# Altium schematic sheet SOC.SchDoc
size A1
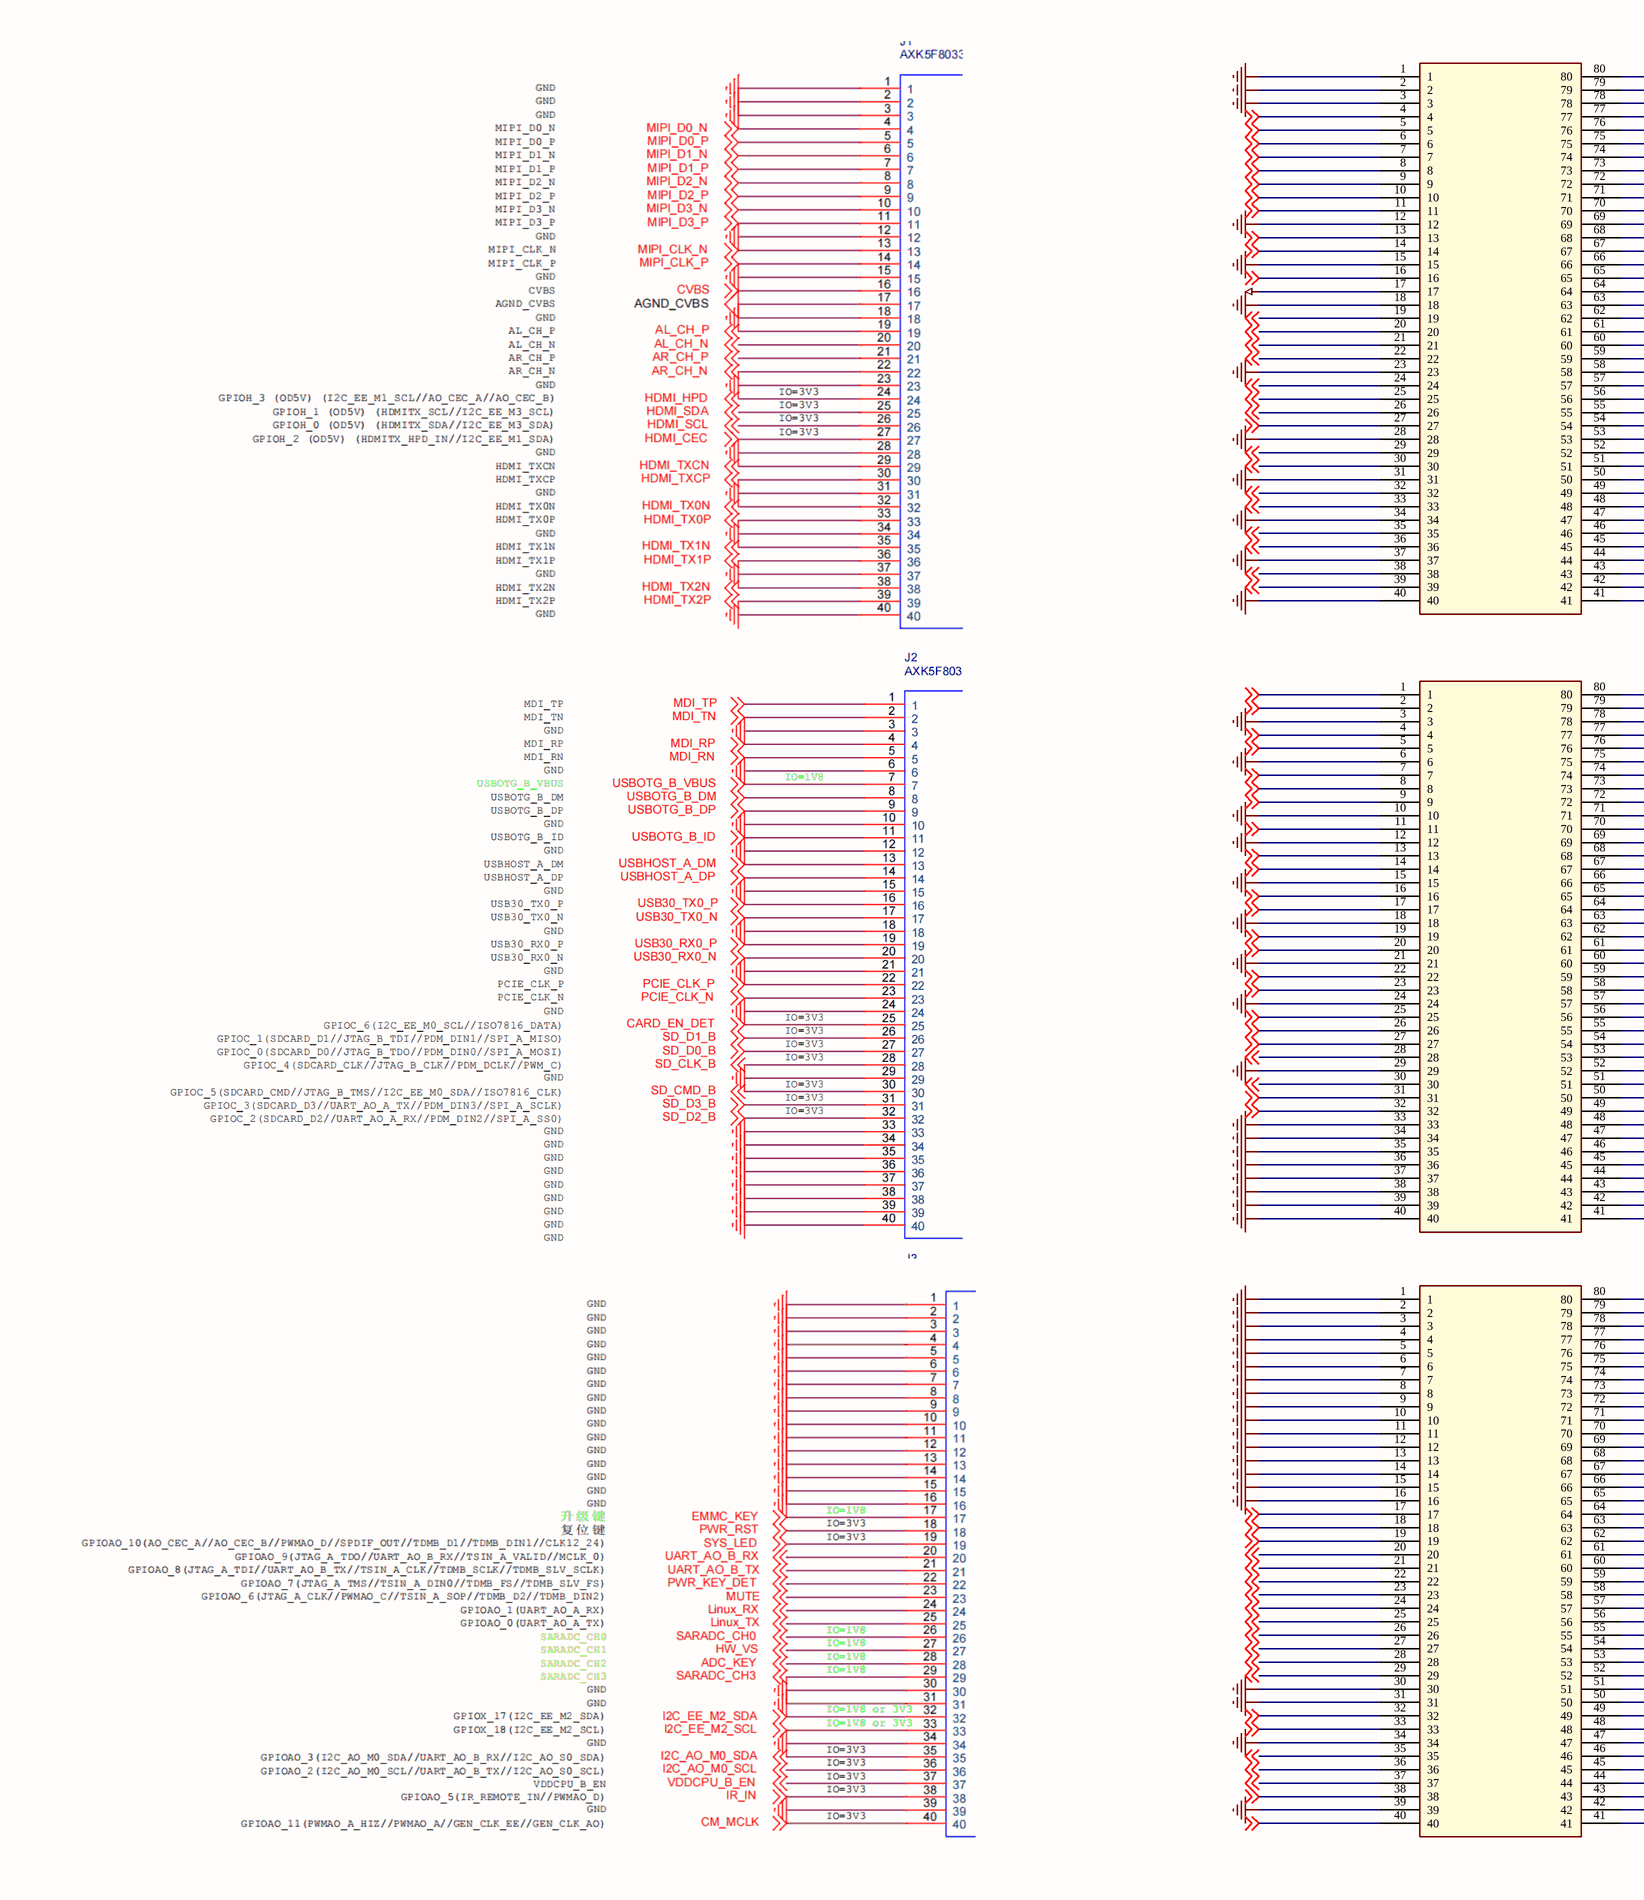
[diagram p0: SOC.SchDoc, left]
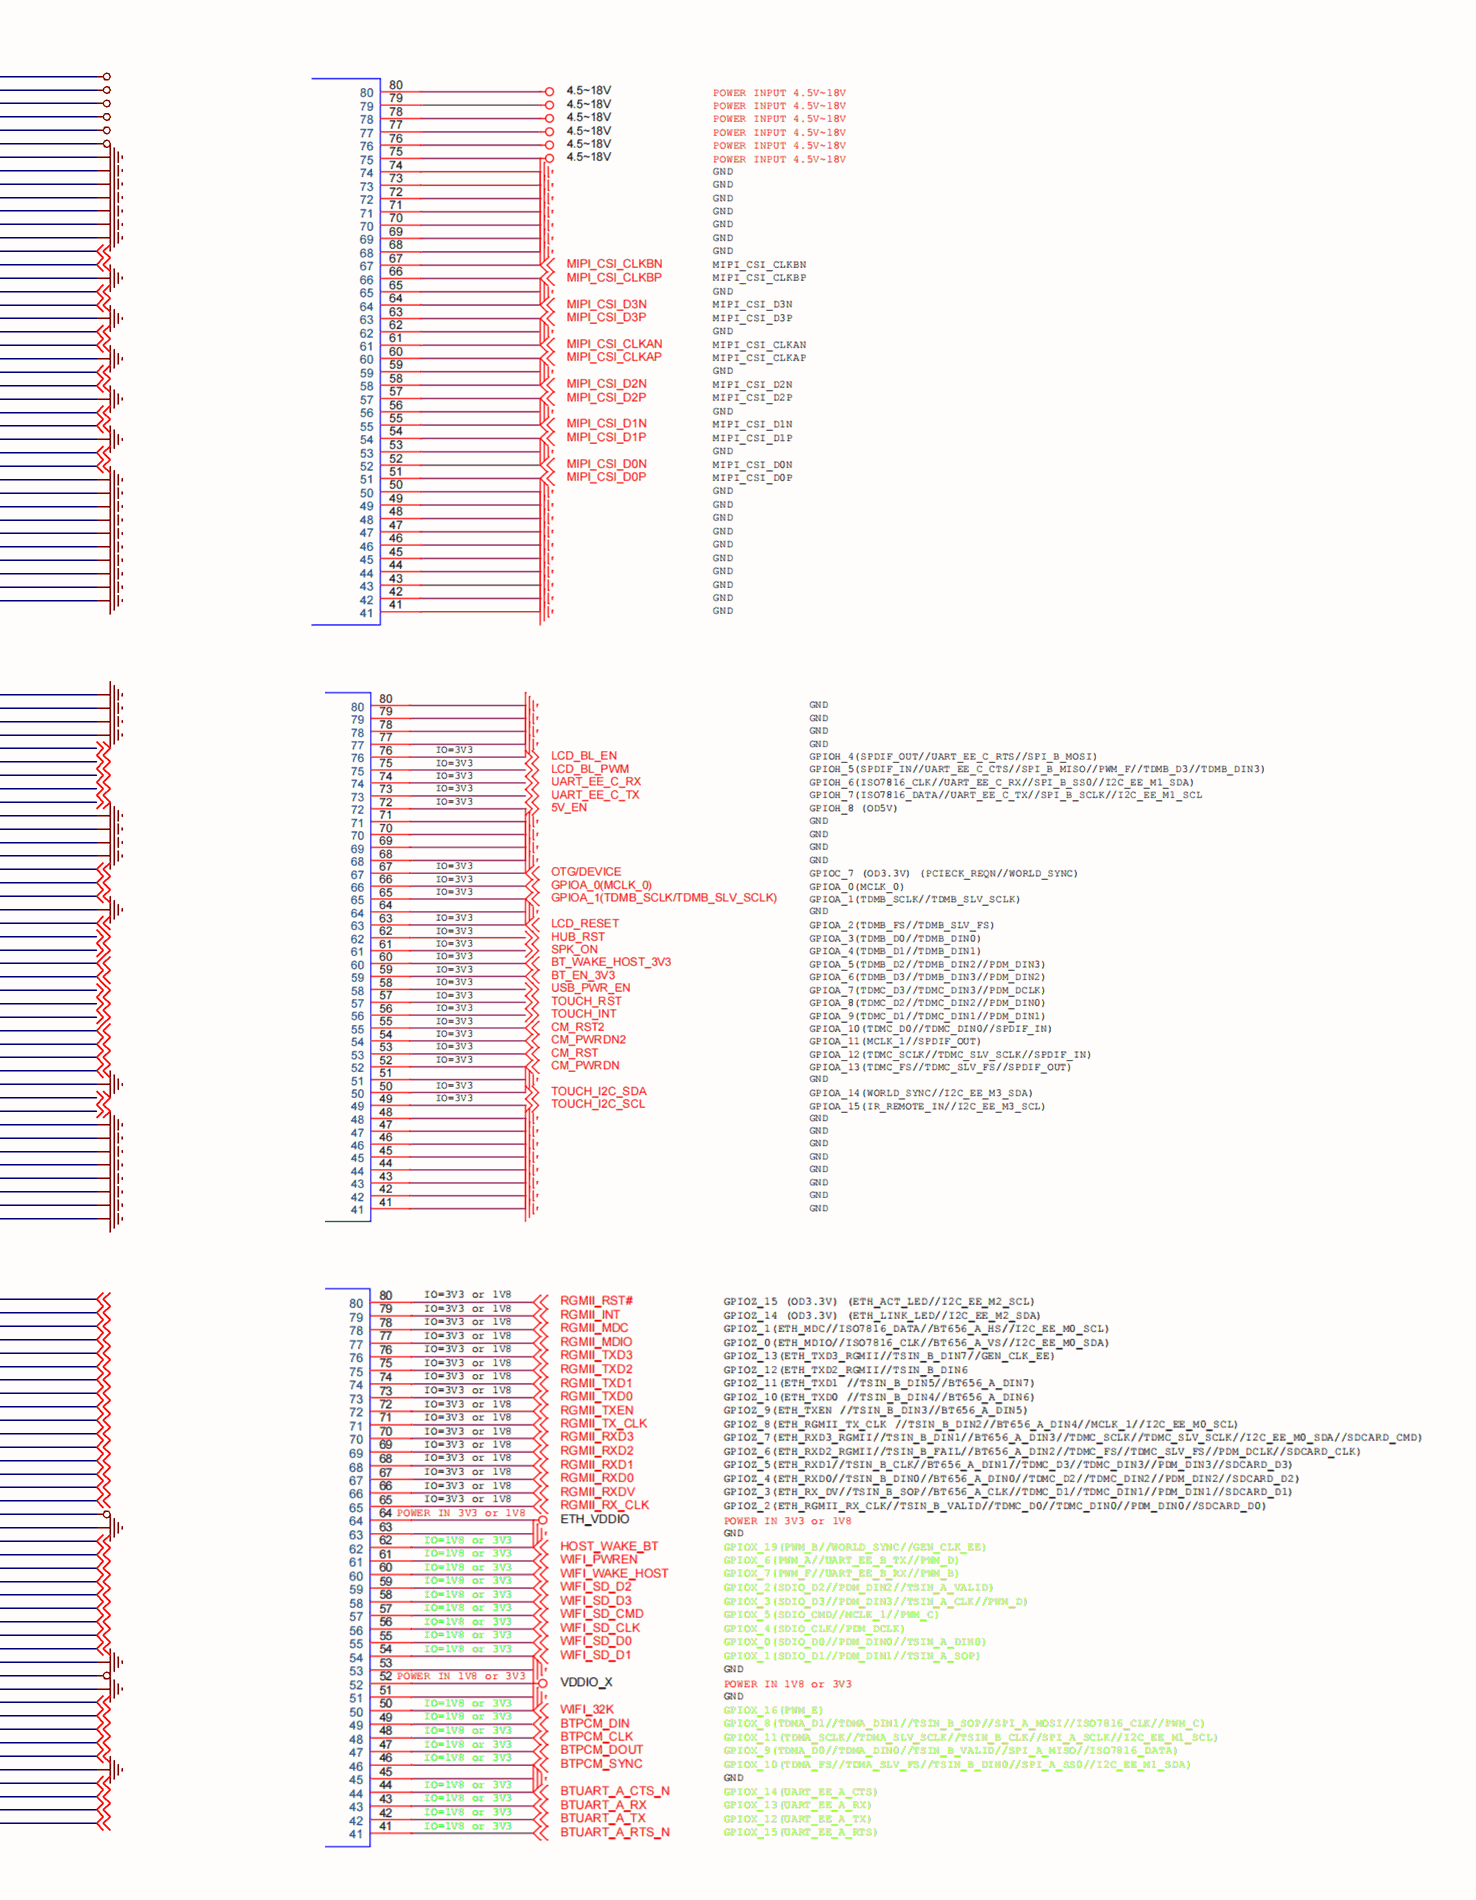
[diagram p1: SOC.SchDoc, right]

## Parts
(Parts that share a designator on the sheet are numbered #1, #2 ... from top to bottom, then left to right.)
J?#1  (no value)
J?#2  (no value)
J?#3  (no value)

## Nets
NetJ?#1_1: J?#1.1 J?#1.2 J?#1.3 J?#1.4 J?#1.5 J?#1.6 J?#1.7 J?#1.8 J?#1.9 J?#1.10 J?#1.11 J?#1.12 J?#1.13 J?#1.14 J?#1.15 J?#1.16 J?#1.17 J?#1.18 J?#1.19 J?#1.20 J?#1.21 J?#1.22 J?#1.23 J?#1.24 J?#1.25 J?#1.26 J?#1.27 J?#1.28 J?#1.29 J?#1.30 J?#1.31 J?#1.32 J?#1.33 J?#1.34 J?#1.35 J?#1.36 J?#1.37 J?#1.38 J?#1.39 J?#1.40 J?#1.41 J?#1.42 J?#1.43 J?#1.44 J?#1.45 J?#1.46 J?#1.47 J?#1.48 J?#1.49 J?#1.50 J?#1.51 J?#1.52 J?#1.53 J?#1.54 J?#1.55 J?#1.56 J?#1.57 J?#1.58 J?#1.59 J?#1.60 J?#1.61 J?#1.62 J?#1.63 J?#1.64 J?#1.65 J?#1.66 J?#1.67 J?#1.68 J?#1.69 J?#1.70 J?#1.71 J?#1.72 J?#1.73 J?#1.74 J?#1.75 J?#1.76 J?#1.77 J?#1.78 J?#1.79 J?#1.80 J?#2.1 J?#2.2 J?#2.3 J?#2.4 J?#2.5 J?#2.6 J?#2.7 J?#2.8 J?#2.9 J?#2.10 J?#2.11 J?#2.12 J?#2.13 J?#2.14 J?#2.15 J?#2.16 J?#2.17 J?#2.18 J?#2.19 J?#2.20 J?#2.21 J?#2.22 J?#2.23 J?#2.24 J?#2.25 J?#2.26 J?#2.27 J?#2.28 J?#2.29 J?#2.30 J?#2.31 J?#2.32 J?#2.33 J?#2.34 J?#2.35 J?#2.36 J?#2.37 J?#2.38 J?#2.39 J?#2.40 J?#2.41 J?#2.42 J?#2.43 J?#2.44 J?#2.45 J?#2.46 J?#2.47 J?#2.48 J?#2.49 J?#2.50 J?#2.51 J?#2.52 J?#2.53 J?#2.54 J?#2.55 J?#2.56 J?#2.57 J?#2.58 J?#2.59 J?#2.60 J?#2.61 J?#2.62 J?#2.63 J?#2.64 J?#2.65 J?#2.66 J?#2.67 J?#2.68 J?#2.69 J?#2.70 J?#2.71 J?#2.72 J?#2.73 J?#2.74 J?#2.75 J?#2.76 J?#2.77 J?#2.78 J?#2.79 J?#2.80 J?#3.1 J?#3.2 J?#3.3 J?#3.4 J?#3.5 J?#3.6 J?#3.7 J?#3.8 J?#3.9 J?#3.10 J?#3.11 J?#3.12 J?#3.13 J?#3.14 J?#3.15 J?#3.16 J?#3.17 J?#3.18 J?#3.19 J?#3.20 J?#3.21 J?#3.22 J?#3.23 J?#3.24 J?#3.25 J?#3.26 J?#3.27 J?#3.28 J?#3.29 J?#3.30 J?#3.31 J?#3.32 J?#3.33 J?#3.34 J?#3.35 J?#3.36 J?#3.37 J?#3.38 J?#3.39 J?#3.40 J?#3.41 J?#3.42 J?#3.43 J?#3.44 J?#3.45 J?#3.46 J?#3.47 J?#3.48 J?#3.49 J?#3.50 J?#3.51 J?#3.52 J?#3.53 J?#3.54 J?#3.55 J?#3.56 J?#3.57 J?#3.58 J?#3.59 J?#3.60 J?#3.61 J?#3.62 J?#3.63 J?#3.64 J?#3.65 J?#3.66 J?#3.67 J?#3.68 J?#3.69 J?#3.70 J?#3.71 J?#3.72 J?#3.73 J?#3.74 J?#3.75 J?#3.76 J?#3.77 J?#3.78 J?#3.79 J?#3.80 ; off-sheet 

## Library data of the parts
J?#1-J?#3 = CON40_0